# Altium schematic sheet Hélice31-LED (1).schdoc
size 230 x 189 mm
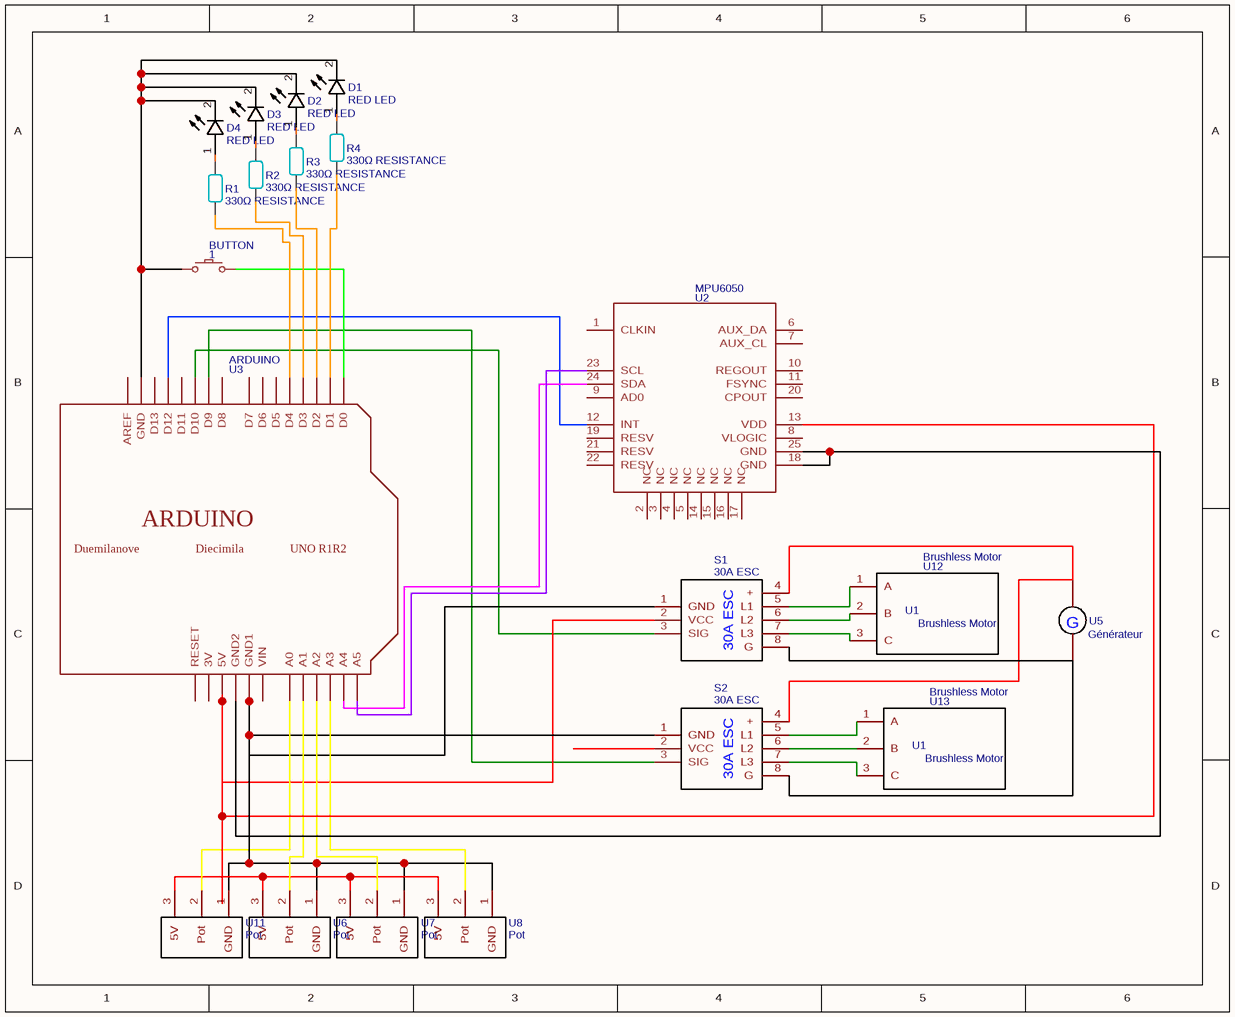
[diagram p0: Hélice31-LED (1).schdoc]

## Parts
1  BUTTON  [32TEETH---CONDUCTIVE-BUTTONS_CONDUCTIVE_BUTTON_DIRECTIONAL_THICK]
D1  RED LED  [LED-TH_LED-DP2-2LED]
D2  RED LED  [LED-TH_LED-DP2-2LED]
D3  RED LED  [LED-TH_LED-DP2-2LED]
D4  RED LED  [LED-TH_LED-DP2-2LED]
R1  330Ω RESISTANCE  [330Ω RESISTANCE]
R2  330Ω RESISTANCE  [330Ω RESISTANCE]
R3  330Ω RESISTANCE  [330Ω RESISTANCE]
R4  330Ω RESISTANCE  [330Ω RESISTANCE]
S1  30A ESC  [SG90 SERVO]
S2  30A ESC  [SG90 SERVO]
U2  MPU6050  [QFN50P400X400X95-25T265X275N]
U3  ARDUINO  [ARDUINO]
U5  Générateur
U6  Pot  [POTENTIOMETRE]
U7  Pot  [POTENTIOMETRE]
U8  Pot  [POTENTIOMETRE]
U11  Pot  [POTENTIOMETRE]
U12  Brushless Motor  [BRUSHLESS MOTOR]
U13  Brushless Motor  [BRUSHLESS MOTOR]

## Nets
Net1_P$ACTIVE: 1.P$ACTIVE U3.D0
Net1_P$GND: 1.P$GND D1.2(K) D2.2(K) D3.2(K) D4.2(K) U3.GND
NetD1_1: D1.1(A) R4.2
NetD2_1: D2.1(A) R3.2
NetD3_1: D3.1(A) R2.2
NetD4_1: D4.1(A) R1.2
NetR1_1: R1.1 U3.D4
NetR2_1: R2.1 U3.D3
NetR3_1: R3.1 U3.D2
NetR4_1: R4.1 U3.D1
NetS1_1: S1.1(GND) S2.1(GND) U3.GND1 U6.1(GND) U7.1(GND) U8.1(GND) U11.1(GND)
NetS1_2: S1.2(VCC) U2.13(VDD) U3.5V
NetS1_3: S1.3(SIG) U3.D10
NetS1_4: S1.4(+) S2.4(+)
NetS1_5: S1.5(L1) U12.1(A)
NetS1_6: S1.6(L2) U12.2(B)
NetS1_7: S1.7(L3) U12.3(C)
NetS1_8: S1.8(G) S2.8(G)
NetS2_3: S2.3(SIG) U3.D9
NetS2_5: S2.5(L1) U13.1(A)
NetS2_6: S2.6(L2) U13.2(B)
NetS2_7: S2.7(L3) U13.3(C)
NetU2_12: U2.12(INT) U3.D12
NetU2_18: U2.18(GND) U2.25(GND) U3.GND2
NetU2_23: U2.23(SCL) U3.A5
NetU2_24: U2.24(SDA) U3.A4
NetU3_A0: U3.A0 U11.2(Pot)
NetU3_A1: U3.A1 U6.2(Pot)
NetU3_A2: U3.A2 U7.2(Pot)
NetU3_A3: U3.A3 U8.2(Pot)
NetU6_3: U6.3(5V) U7.3(5V) U8.3(5V) U11.3(5V)

Not connected (* = marked no-connect by the designer): S2 2(VCC); U2 1(CLKIN) 2(NC) 3(NC) 4(NC) 5(NC) 6(AUX_DA) 7(AUX_CL) 8(VLOGIC) 9(AD0) 10(REGOUT) 11(FSYNC) 14(NC) 15(NC) 16(NC) 17(NC) 19(RESV) 20(CPOUT) 21(RESV) 22(RESV); U3 3V AREF D5 D6 D7 D8 D11 D13 RESET VIN; U5 1 2

## Notes on the sheet
- (in symbol ARDUINO) Duemilanove; Diecimila; UNO R1R2
- (in symbol Brushless Motor) U1
- (in symbol Générateur) G

## Library data of the parts
1 = BUTTON: Contributor: LorenzoVonMatterhorn; spicePre: ?; spiceSymbolName: BUTTON
D1-D4 = RED LED: Manufacturer: VccLite; Manufacturer Part: 5600; Contributor: peycar; Supplier: Digi-Key; Supplier Part: L20325-ND; link: https://vcclite.com/product/5602f5-5v/; spicePre: D; spiceSymbolName: 3mm Green TH LED 5600
R1-R4 = 330Ω RESISTANCE: Contributor: pritams07; Supplier Part: C410657; Supplier: LCSC; spicePre: R; spiceSymbolName: 330Ω RESISTANCE
S1 S2 = 30A ESC: Contributor: ilos; spicePre: S; spiceSymbolName: 30A ESC
U3 = ARDUINO: Contributor: Adafruit; spicePre: U; spiceSymbolName: ARDUINO
U5 = Générateur: Contributor: oswin03; spicePre: U; spiceSymbolName: Générateur
U6-U8 U11 = Pot: Contributor: merlu.timothee; spicePre: U; spiceSymbolName: Pot
U12 U13 = Brushless Motor: Contributor: Droners; Manufacturer: N/A; Manufacturer Part: N/A; Supplier Part: N/A; spicePre: U; spiceSymbolName: Brushless Motor
U2 = MPU6050: spicePre: U; spiceSymbolName: MPU6050